# Altium schematic sheet RELAY_IM02TS.SchDoc
size A3
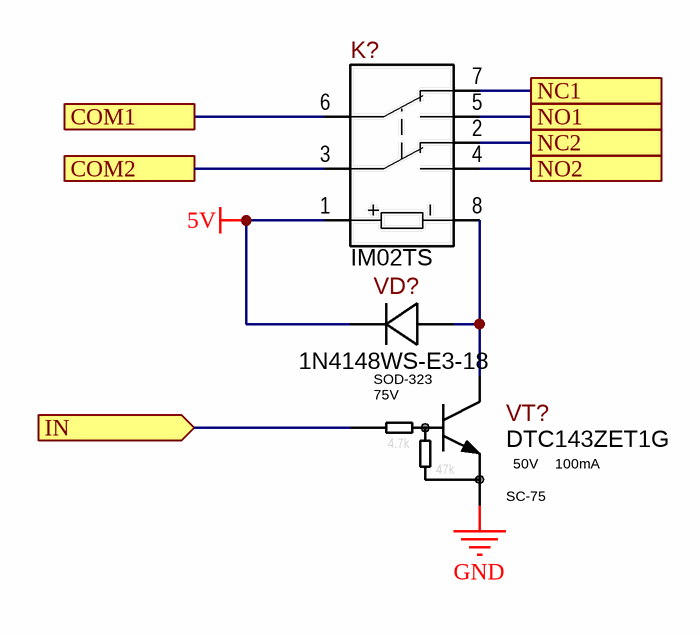
[diagram p0: RELAY_IM02TS.SchDoc]

## Parts
K?  IM02TS  [IMxxTS-Series]
VD?  Package: SOD-323  Voltage: 75V  [SOD-323_MED]  (hidden comment: 1N4148WS-E3-18)
VT?  Package: SC-75  Vce: 50V  Ic: 100mA  [SOT-416]  (hidden comment: DTC143ZET1G)

## Ports
COM1, COM2, IN (in), NC1, NC2, NO1, NO2

## Nets
5V: K?.1(Coil+) VD?.CA
GND: VT?.2(E)
COM1: K?.6(2-COM) ; port COM1
COM2: K?.3(1-COM) ; port COM2
IN: VT?.1(B) ; port IN
NC1: K?.7(2-CLOSED) ; port NC1
NC2: K?.2(1-CLOSED) ; port NC2
NO1: K?.5(2-OPEN) ; port NO1
NO2: K?.4(1-OPEN) ; port NO2
NetK?_8: K?.8(Coil-) VD?.AN VT?.3(C)

## Notes on the sheet
- (in symbol DTC143ZET1G) 4.7k; 47k

## Library data of the parts
K? = IM02TS: Telecom Relay, DPDT (2 Form C) Through Hole, 4.5VDC Coil, 2A/220VDC Max; Manufacturer: TE Connectivity; Ajax_1C_ID: 14042; Ajax_1C_PN: IM02TS IM Relay 2 Pole; Component Status: Released; Replacement: NONE; GUID_1C: f3edab62-d147-11e8-ab49-0050569f2651; Ajax_1С_Status: RND Only; Part Number: IM02TS; Part Type: Relay; Component Type: PTH; Temperature Range: -40°C ~ 85°C; ComponentLink1URL: https://www.te.com/commerce/DocumentDelivery/DDEController?Action=srchrtrv&DocNm=1-1773734-7_IM_Relay_I_Type&DocType=DS&DocLang=English; Supplier 1: Digi-Key; Supplier Part Number 1: PB1093-ND; ComponentLink1Description: Datasheet; Price: 3,68
VD? = 1N4148WS-E3-18: Fast Switching Diode 75V 150mA, SOD-323; Manufacturer: Vishay Semiconductor; Ajax_1C_ID: 24489; Ajax_1C_PN: 1N4148WS-E3-18 100V 0.15A Vishay Rectifier Diode SOD-323; Ajax_1С_Status: Mass Production; Marking: A2; Component Status: Released; Standard Lead Time: 93 Weeks; Vf: 1.2V @ 100mA; Replacement: NONE; GUID_1C: f7a34665-33c2-11eb-ab6e-0050569f2651; Part Number: 1N4148WS-E3-18; Part Type: Fast Switching; Component Type: SMD; Current: 150mA; Temperature Range: -55°C ~ 150°C; ComponentLink1URL: \\altiumdb.ajax.local\files\Datasheet\Diodes\1N4148WS-E3-18.pdf; Supplier 1: Arrow; Supplier Part Number 1: 1N4148WS-E3-18; Price: 0,01596655; ComponentLink1Description: Datasheet
VT? = DTC143ZET1G: 50V, 100mA Low Vce(sat) NPN Digital Transistor, Pre-Biased 4.7k/47k (with built-in resistors); Manufacturer: Onsemi; Ajax_1C_ID: 9410; Ajax_1C_PN: DTC143ZET1G SC-75-3  биполярный NPN транзистор; Component Status: Released; Standard Lead Time: 8 Weeks; Replacement: NONE; GUID_1C: d76ac5d5-de69-11e6-829b-d8cb8a9acc66; Ajax_1С_Status: Mass Production; Part Number: DTC143ZET1G; Part Type: NPN; Component Type: SMD; Temperature Range: -55°C ~ 150 °C; ComponentLink1URL: http://www.onsemi.com/pub/Collateral/DTC143Z-D.PDF; Supplier 1: Digi-Key; Supplier Part Number 1: DTC143ZET1GOSTR-ND; ComponentLink1Description: Datasheet; Price: 0,0125